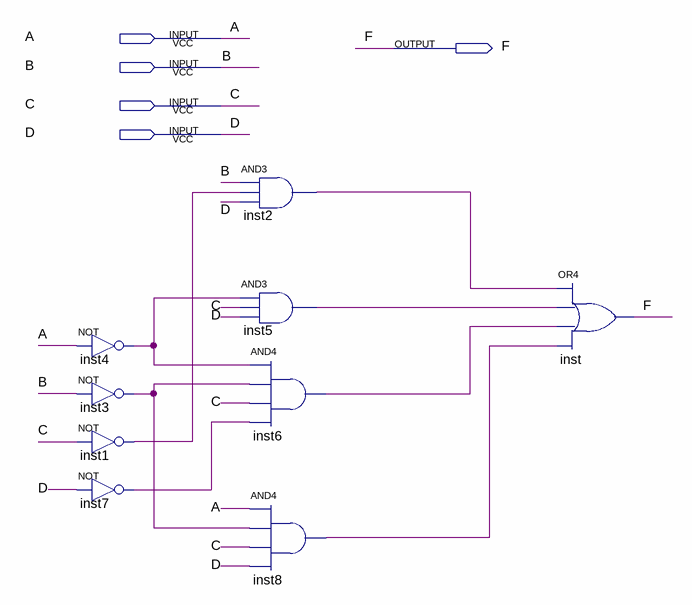
[diagram p0: schematic sheet]
// Quartus schematic prime.bdf as structural Verilog: 9 symbols, 5 pins
module prime (
  input  A,
  input  B,
  input  C,
  input  D,
  output F
);

  wire inst1_out, inst2_out, inst3_out, inst4_out, inst5_out, inst6_out, inst7_out, inst8_out;

  not inst4 (inst4_out, A);
  not inst3 (inst3_out, B);
  not inst1 (inst1_out, C);
  not inst7 (inst7_out, D);
  and inst2 (inst2_out, B, inst1_out, D);
  and inst5 (inst5_out, inst4_out, C, D);
  and inst6 (inst6_out, inst4_out, inst3_out, C, inst7_out);
  and inst8 (inst8_out, A, inst3_out, C, D);
  or inst (F, inst2_out, inst5_out, inst6_out, inst8_out);
endmodule
